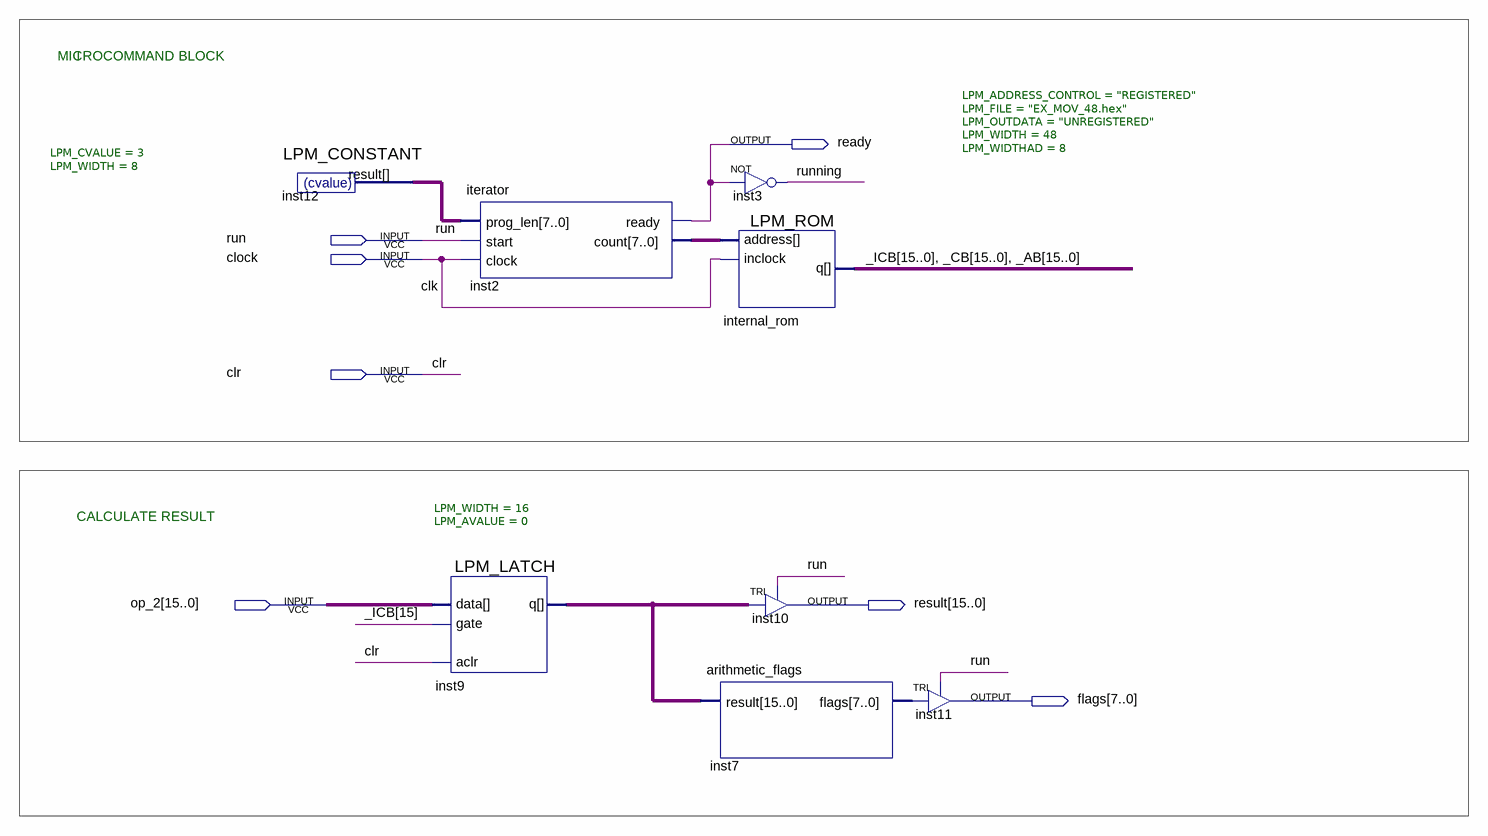
[diagram p0: schematic sheet]
// Quartus schematic EX_MOV.bdf as structural Verilog: 8 symbols, 7 pins
module EX_MOV (
  input  run,
  input  clock,
  input  clr,
  input  [15:0] op_2,
  output ready,
  output [15:0] result,
  output [7:0] flags
);

  wire running;
  wire [7:0] inst2_count, inst7_flags, inst12_result;
  wire [15:0] _AB, _CB, _ICB, inst9_q;

  LPM_CONSTANT #(.LPM_CVALUE(3), .LPM_WIDTH(8)) inst12 (.result(inst12_result));
  LPM_LATCH #(.LPM_WIDTH(16), .LPM_AVALUE(0)) inst9 (.aclr(clr), .data(op_2), .gate(_ICB[15]), .q(inst9_q));
  iterator inst2 (.prog_len(inst12_result), .start(run), .clock(clock), .ready(ready), .count(inst2_count));
  not inst3 (running, ready);
  LPM_ROM #(.LPM_ADDRESS_CONTROL("REGISTERED"), .LPM_FILE("EX_MOV_48.hex"), .LPM_OUTDATA("UNREGISTERED"), .LPM_WIDTH(48), .LPM_WIDTHAD(8)) internal_rom (
    .address(inst2_count), .inclock(clock), .q({_ICB, _CB, _AB}));
  TRI inst10[15:0] (.IN(inst9_q), .OE(run), .OUT(result));
  arithmetic_flags inst7 (.result(inst9_q), .flags(inst7_flags));
  TRI inst11[7:0] (.IN(inst7_flags), .OE(run), .OUT(flags));

  // Other names for the same wires on the sheet: clk = clock

  // Notes on the sheet:
  //   MICROCOMMAND BLOCK
  //   I
  //   CALCULATE RESULT
endmodule
